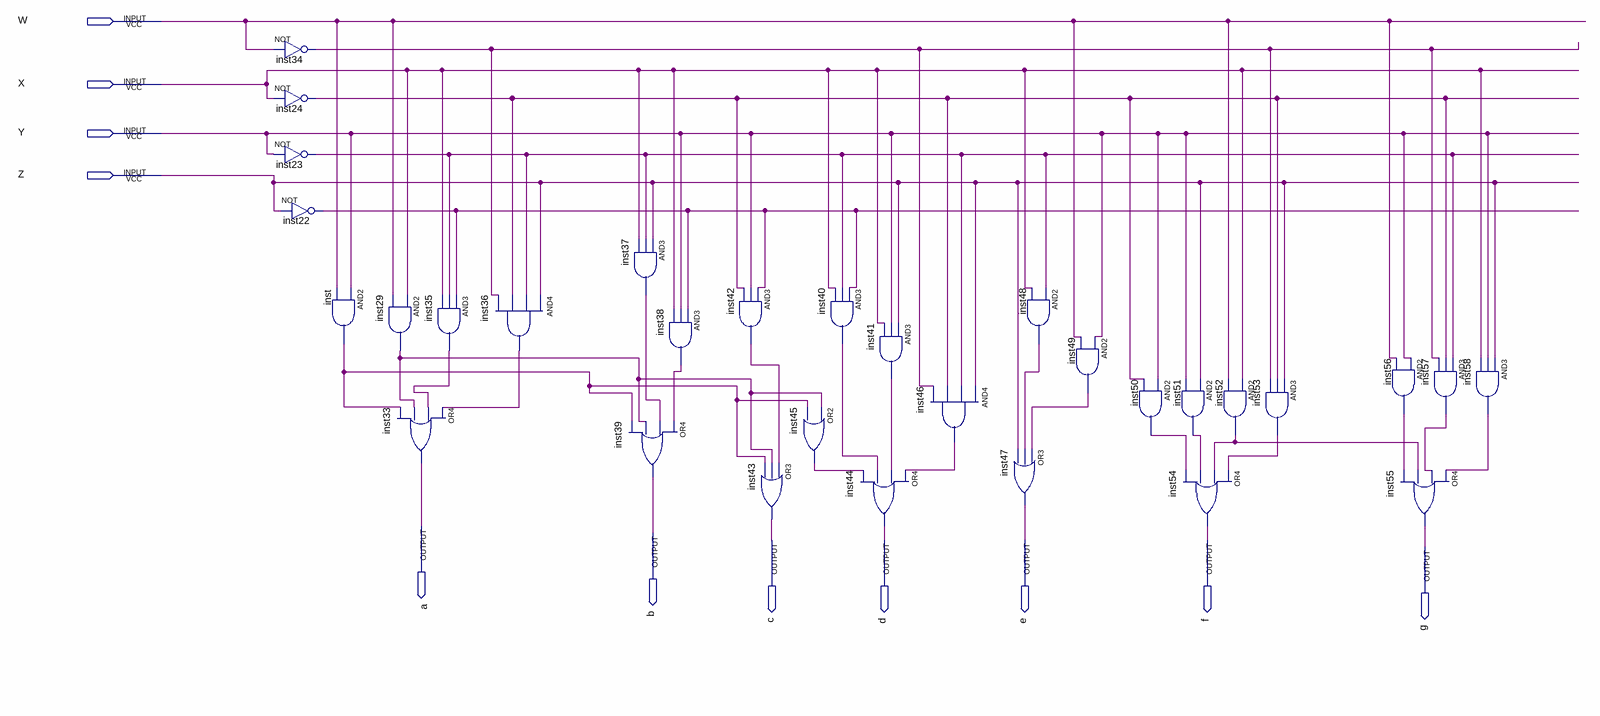
[diagram p0: schematic sheet]
// Quartus schematic decodificador_bcd.bdf as structural Verilog: 31 symbols, 11 pins
module decodificador_bcd (
  input  W,
  input  X,
  input  Y,
  input  Z,
  output a,
  output b,
  output c,
  output d,
  output e,
  output f,
  output g
);

  wire inst22_out, inst23_out, inst24_out, inst29_out, inst34_out, inst35_out, inst36_out, inst37_out,
       inst38_out, inst40_out, inst41_out, inst42_out, inst45_out, inst46_out, inst48_out, inst49_out,
       inst50_out, inst51_out, inst52_out, inst53_out, inst56_out, inst57_out, inst58_out, inst_out;

  not inst34 (inst34_out, W);
  not inst24 (inst24_out, X);
  not inst23 (inst23_out, Y);
  not inst22 (inst22_out, Z);
  and inst (inst_out, Y, W);
  and inst29 (inst29_out, X, W);
  or inst33 (a, inst36_out, inst35_out, inst29_out, inst_out);
  and inst35 (inst35_out, inst22_out, inst23_out, X);
  and inst36 (inst36_out, Z, inst23_out, inst24_out, inst34_out);
  or inst39 (b, inst38_out, inst37_out, inst29_out, inst_out);
  and inst37 (inst37_out, Z, inst23_out, X);
  and inst38 (inst38_out, inst22_out, Y, X);
  and inst42 (inst42_out, inst22_out, Y, inst24_out);
  or inst43 (c, inst42_out, inst29_out, inst_out);
  and inst40 (inst40_out, inst22_out, inst23_out, X);
  or inst45 (inst45_out, inst29_out, inst_out);
  and inst41 (inst41_out, Z, Y, X);
  or inst44 (d, inst46_out, inst41_out, inst40_out, inst45_out);
  and inst46 (inst46_out, Z, inst23_out, inst24_out, inst34_out);
  or inst47 (e, inst49_out, inst48_out, Z);
  and inst48 (inst48_out, inst23_out, X);
  and inst49 (inst49_out, Y, W);
  and inst50 (inst50_out, Y, inst24_out);
  and inst51 (inst51_out, Z, Y);
  or inst54 (f, inst53_out, inst52_out, inst51_out, inst50_out);
  and inst52 (inst52_out, X, W);
  and inst53 (inst53_out, Z, inst24_out, inst34_out);
  and inst56 (inst56_out, Y, W);
  or inst55 (g, inst58_out, inst57_out, inst52_out, inst56_out);
  and inst57 (inst57_out, inst23_out, inst24_out, inst34_out);
  and inst58 (inst58_out, Z, Y, X);
endmodule
